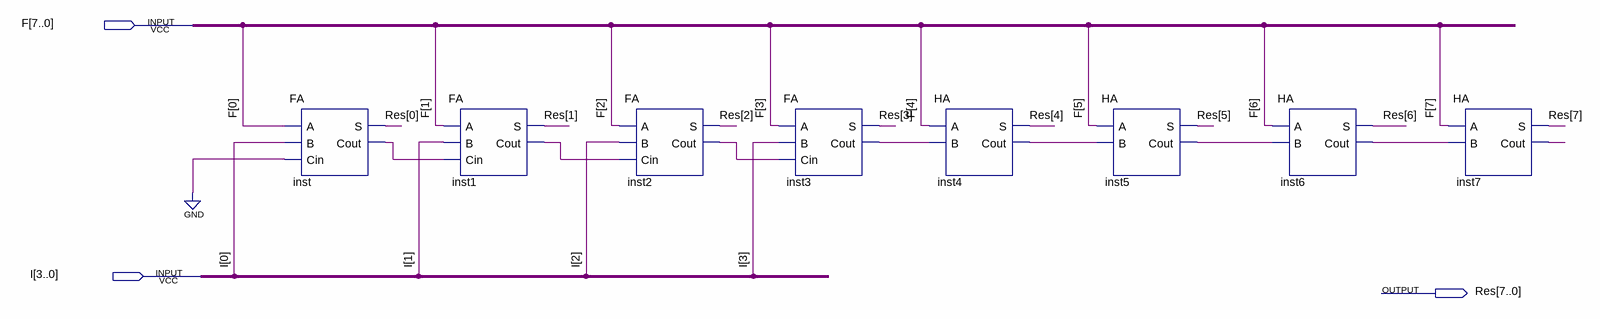
[diagram p0: schematic sheet]
// Quartus schematic Adder8_4bits.bdf as structural Verilog: 8 symbols, 3 pins
module Adder8_4bits (
  input  [7:0] F,
  input  [3:0] I,
  output [7:0] Res
);

  wire inst1_cout, inst2_cout, inst3_cout, inst4_cout, inst5_cout, inst6_cout, inst7_cout, inst_cout;

  FA inst (.A(F[0]), .B(I[0]), .Cin(1'b0), .S(Res[0]), .Cout(inst_cout));
  FA inst1 (.A(F[1]), .B(I[1]), .Cin(inst_cout), .S(Res[1]), .Cout(inst1_cout));
  FA inst2 (.A(F[2]), .B(I[2]), .Cin(inst1_cout), .S(Res[2]), .Cout(inst2_cout));
  FA inst3 (.A(F[3]), .B(I[3]), .Cin(inst2_cout), .S(Res[3]), .Cout(inst3_cout));
  HA inst4 (.A(F[4]), .B(inst3_cout), .S(Res[4]), .Cout(inst4_cout));
  HA inst5 (.A(F[5]), .B(inst4_cout), .S(Res[5]), .Cout(inst5_cout));
  HA inst6 (.A(F[6]), .B(inst5_cout), .S(Res[6]), .Cout(inst6_cout));
  HA inst7 (.A(F[7]), .B(inst6_cout), .S(Res[7]), .Cout(inst7_cout));
endmodule
